# Altium schematic sheet GNSS.SchDoc: Módulo GNSS
size A4; Date: *******; ApprovedBy: *******; CheckedBy: Alberte Gil; Author: *******; CompanyName: *******; DrawnBy: Mario de Miguel; Engineer: *******; Organization: *******; Address1: *******; Address2: *******; Address3: *******; Address4: *******; DocumentNumber: 4; Revision: *******; SheetNumber: 4; SheetTotal: 5; CurrentTime: *******; CurrentDate: *******; Time: *******; DocumentFullPathAndName: *******; DocumentName: *******; ModifiedDate: *******; ImagePath: *******; ProjectName: *******; Application_BuildNumber: *******
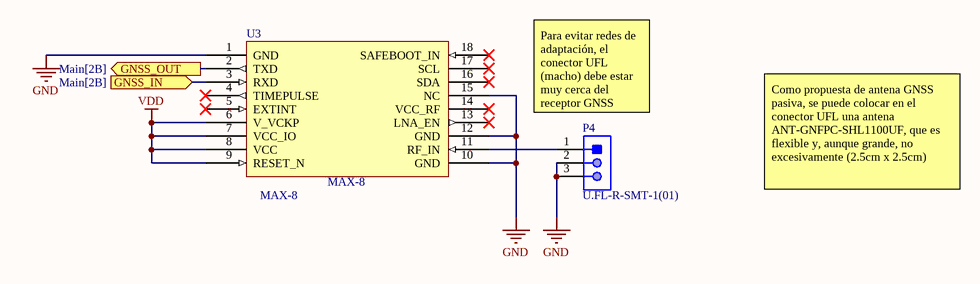
[diagram p0: GNSS.SchDoc]

## Parts
P4  U.FL-R-SMT-1(01)  [HRS-U.FL-R-SMT-3_V]
U3  MAX-8  [MAX-8 LCC18]

## Ports
GNSS_IN (in, see Main[2B]), GNSS_OUT (out, see Main[2B])

## Nets
GND: P4.2 P4.3 U3.1(GND) U3.10(GND) U3.12(GND) U3.15(NC)
VDD: U3.6(V_VCKP) U3.7(VCC_IO) U3.8(VCC) U3.9(RESET_N)
GNSS_IN: U3.3(RXD) ; port GNSS_IN
GNSS_OUT: U3.2(TXD) ; port GNSS_OUT
NetP4_1: P4.1 U3.11(RF_IN)

Not connected (* = marked no-connect by the designer): U3 4(TIMEPULSE)* 5(EXTINT)* 13(LNA_EN)* 14(VCC_RF)* 16(SDA)* 17(SCL)* 18(SAFEBOOT_IN)*

## Notes on the sheet
- (near P4) Para evitar redes de adaptación, el conector UFL (macho) debe estar muy cerca del receptor GNSS
- Como propuesta de antena GNSS pasiva, se puede colocar en el conector UFL una antena
  ANT-GNFPC-SHL1100UF, que es flexible y, aunque grande, no excesivamente (2.5cm x 2.5cm)
- Title:
- Drawn By:
- Page Contents:
- Checked By:
- Size:
- Date:
- File:
- License:
- Email:
- A4
- Number:
- Time:
- Revision:
- Sheet
- Website:
- of

## Library data of the parts
P4 = CMP-2000-05153-1: Ultra Small Coaxial Connector, 6 GHz, -40 to 90 degC, 3-Pin SMD, RoHS, Bulk; Manufacturer: Hirose Electric; Connector Style: U.FL; Impedance: 50Ohm; Dielectric Material: LiquidCrystalPolymer(LCP); Minimum Quantity: UltraMiniatureCoaxial; Online Catalog: U.FLSeries; Featured Product: HiroseU.FLSeries; Frequency - Max: 6GHz; Other Names: H122041 / U.FL-R-SMT-1(01)-ND; Contact Termination: Solder; Body Material: PhosphorBronze; Connector Type: Jack,MalePin; Body Finish: Silver; Center Contact Plating: Gold; Manufacturer URL: https://www.hirose.com; Family: CoaxialConnectors(RF); Fastening Type: Snap-On; Unit PriceUSD: U.FL; Series: U.FL; Package Reference: U.FL-R-SMT; Packaging: Bulk; Standard Package: 100; Mounting Type: SurfaceMount; Quantity Available: Bulk; Housing Color: Silver; Package Description: 3-Pin Surface Mount Device, Body 2.6 x 2.6 mm; Category: Connectors,Interconnects; Operating Temperature: -40degC~90degC; Center Contact Material: PhosphorBronze; Dynamic Catalog: U.FLSeries; Datasheet URL: https://datasheet.ciiva.com/26945/getdatasheetpartid-475239-26945414.pdf; Datasheet Version: Feb-09; Shield Termination: Solder